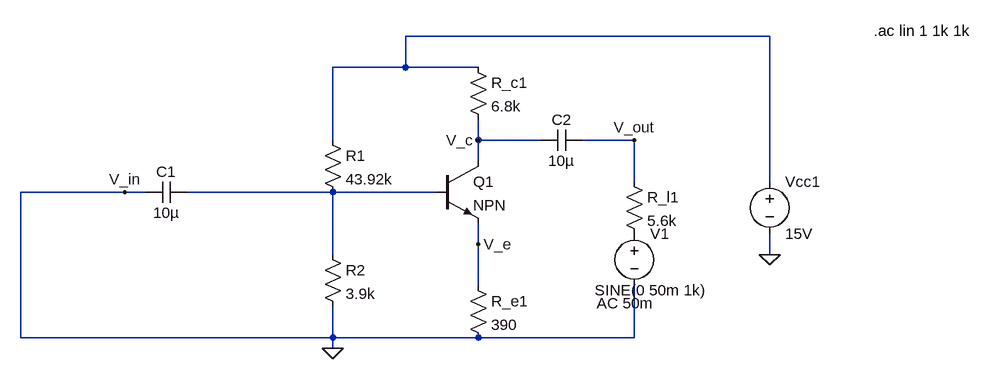
[diagram p0: schematic R_output_amplifier.asc]
R_output_amplifier.asc, the LTspice schematic file:
Version 4
SHEET 1 908 680
WIRE 592 0 32 0
WIRE 32 48 32 0
WIRE 32 48 -80 48
WIRE 144 48 32 48
WIRE -80 160 -80 48
WIRE 144 160 144 128
WIRE 240 160 144 160
WIRE 384 160 304 160
WIRE 144 192 144 160
WIRE 384 224 384 160
WIRE 592 224 592 0
WIRE -400 240 -560 240
WIRE -368 240 -400 240
WIRE -80 240 -304 240
WIRE 80 240 -80 240
WIRE 144 320 144 288
WIRE -80 336 -80 240
WIRE 592 336 592 304
WIRE 144 384 144 320
WIRE -560 464 -560 240
WIRE -80 464 -80 416
WIRE -80 464 -560 464
WIRE 144 464 -80 464
WIRE 384 464 384 384
WIRE 384 464 144 464
WIRE -80 480 -80 464
FLAG -80 480 0
FLAG 592 336 0
FLAG 144 160 V_c
FLAG 144 320 V_e
FLAG -400 240 V_in
FLAG 384 160 V_out
SYMBOL npn 80 192 R0
SYMATTR InstName Q1
SYMBOL res 128 32 R0
SYMATTR InstName R_c1
SYMATTR Value 6.8k
SYMBOL res -96 144 R0
SYMATTR InstName R1
SYMATTR Value 43.92k
SYMBOL res -96 320 R0
SYMATTR InstName R2
SYMATTR Value 3.9k
SYMBOL res 128 368 R0
SYMATTR InstName R_e1
SYMATTR Value 390
SYMBOL res 368 208 R0
SYMATTR InstName R_l1
SYMATTR Value 5.6k
SYMBOL cap -304 224 R90
WINDOW 0 0 32 VBottom 2
WINDOW 3 32 32 VTop 2
SYMATTR InstName C1
SYMATTR Value 10µ
SYMBOL cap 240 176 R270
WINDOW 0 32 32 VTop 2
WINDOW 3 0 32 VBottom 2
SYMATTR InstName C2
SYMATTR Value 10µ
SYMBOL voltage 592 208 R0
WINDOW 123 0 0 Left 0
WINDOW 39 0 0 Left 0
SYMATTR InstName Vcc1
SYMATTR Value 15V
SYMBOL voltage 384 288 R0
WINDOW 3 -61 103 Left 2
WINDOW 123 -58 123 Left 2
WINDOW 39 0 0 Left 0
SYMATTR Value SINE(0 50m 1k)
SYMATTR Value2 AC 50m
SYMATTR InstName V1
TEXT 752 -8 Left 2 !.ac lin 1 1k 1k

The netlist it stands for:
* R_output_amplifier.asc
Q1 V_c N002 V_e 0 NPN
R_c1 N001 V_c 6.8k
R1 N001 N002 43.92k
R2 N002 0 3.9k
R_e1 V_e 0 390
R_l1 V_out P001 5.6k
C1 N002 0 10µ
C2 V_c V_out 10µ
Vcc1 N001 0 15V
V1 P001 0 SINE(0 50m 1k) AC 50m
.model NPN NPN
.model PNP PNP
.lib standard.bjt
.ac lin 1 1k 1k
.backanno
.end